# Altium schematic sheet Orange_pi_zero.SchDoc: Humpback
size 420 x 297 mm; Author: G.Kasprowicz; CompanyName: WUT ISE; DrawnBy: G.Kasprowicz; Organization: WUT ISE; Address1: PW ISE; Address2: Nowowiejska 15/19 00-665 Warsaw; Address3: gkasprow@gmail.com; DocumentNumber: 10; Revision: 1.0; SheetNumber: 10; SheetTotal: 11; ModifiedBy: -; CheckedDate: -; Title2: OrangePi Zero; DivGrp: WUT ISE; Designer: G.Kasprowicz; ModifiedDate: -; ProjectName: Sensor Box
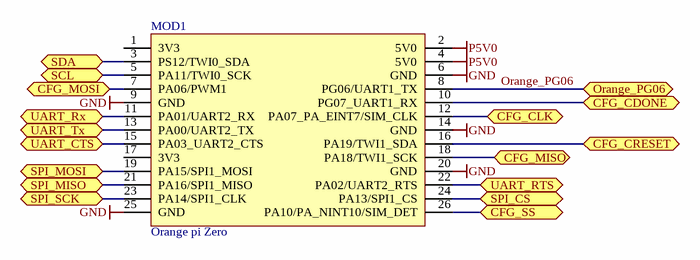
[diagram p0: Orange_pi_zero.SchDoc]

## Parts
MOD1  Orange pi Zero  [MOD_Orange_pi_Zero]

## Ports
CFG_CDONE (bidir), CFG_CLK (bidir), CFG_CRESET (bidir), CFG_MISO (bidir), CFG_MOSI (bidir), CFG_SS (bidir), Orange_PG06 (bidir), SCL (bidir), SDA (bidir), SPI_CS (bidir), SPI_MISO (bidir), SPI_MOSI (bidir), SPI_SCK (bidir), UART_CTS (bidir), UART_RTS (bidir), UART_Rx (bidir), UART_Tx (bidir)

## Nets
GND: MOD1.6(GND) MOD1.9(GND) MOD1.14(GND) MOD1.20(GND) MOD1.25(GND)
P5V0: MOD1.2(5V0) MOD1.4(5V0)
CFG_CDONE: MOD1.10(PG07_UART1_RX) ; port CFG_CDONE
CFG_CLK: MOD1.12(PA07_PA_EINT7/SIM_CLK) ; port CFG_CLK
CFG_CRESET: MOD1.16(PA19/TWI1_SDA) ; port CFG_CRESET
CFG_MISO: MOD1.18(PA18/TWI1_SCK) ; port CFG_MISO
CFG_MOSI: MOD1.7(PA06/PWM1) ; port CFG_MOSI
CFG_SS: MOD1.26(PA10/PA_NINT10/SIM_DET) ; port CFG_SS
Orange_PG06: MOD1.8(PG06/UART1_TX) ; port Orange_PG06
SCL: MOD1.5(PA11/TWI0_SCK) ; port SCL
SDA: MOD1.3(PS12/TWI0_SDA) ; port SDA
SPI_CS: MOD1.24(PA13/SPI1_CS) ; port SPI_CS
SPI_MISO: MOD1.21(PA16/SPI1_MISO) ; port SPI_MISO
SPI_MOSI: MOD1.19(PA15/SPI1_MOSI) ; port SPI_MOSI
SPI_SCK: MOD1.23(PA14/SPI1_CLK) ; port SPI_SCK
UART_CTS: MOD1.15(PA03_UART2_CTS) ; port UART_CTS
UART_RTS: MOD1.22(PA02/UART2_RTS) ; port UART_RTS
UART_Rx: MOD1.11(PA01/UART2_RX) ; port UART_Rx
UART_Tx: MOD1.13(PA00/UART2_TX) ; port UART_Tx

Not connected (* = marked no-connect by the designer): MOD1 1(3V3) 17(3V3)

## Notes on the sheet
- Project/Equipment
- Document
- Designer
- Drawn by
- Check.by
- Copyright WUT ISE 2018.
  This documentation describes Open Hardware and is licensed under the CERN OHL v.1.1. You may redistribute and modify this documentation under the terms of the CERN OHL v.1.1. (http://ohwr.org/CERNOHL). This documentation is distributed WITHOUT ANY EXPRESS OR IMPLIED WARRANTY, INCLUDING OF MERCHANTABILITY, SATISFACTORY QUALITY AND FITNESS FOR A PARTICULAR PURPOSE. Please see the CERN OHL v.1.1 for applicable conditions.
- Contact
- File
- Last Mod.
- Print Date
- Sheet
- Size
- A3
- of
- Rev

## Library data of the parts
MOD1 = MOD_Orange_pi_Zero